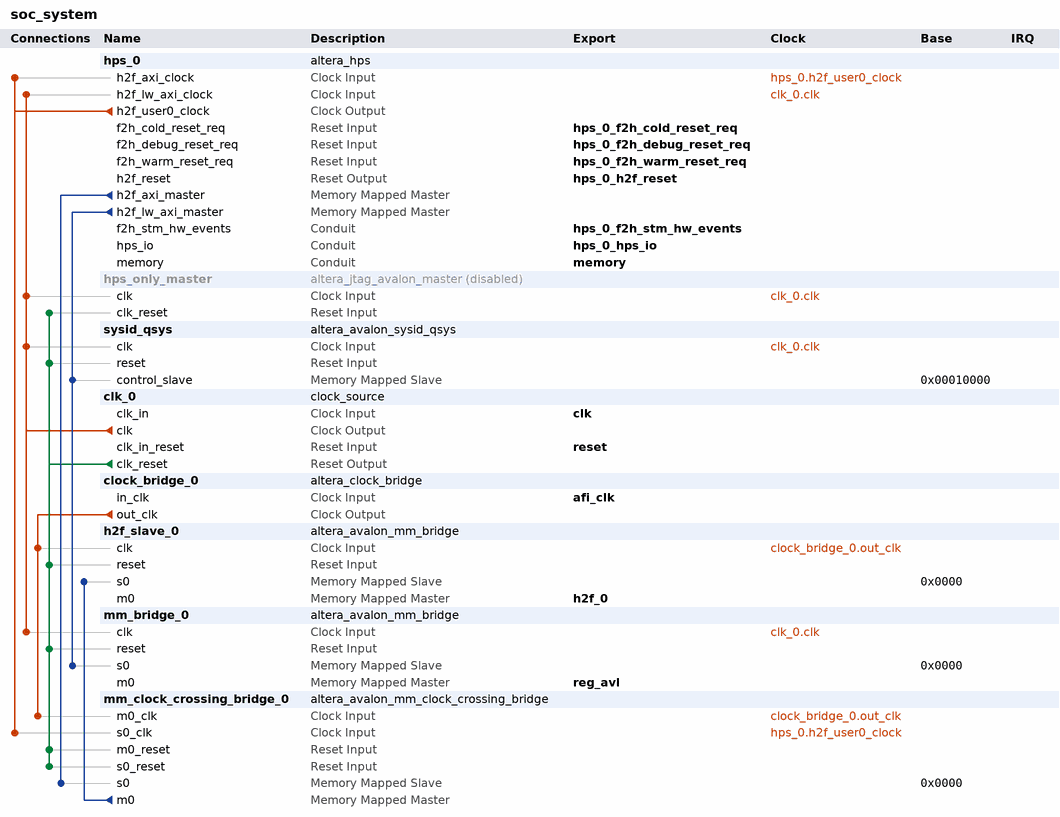
[diagram p0: system contents]
# Platform Designer (Qsys) system soc_system, Cyclone V 5CSXFC6D6F31C6
# Parameters at their usual value, and those the tool derives, are not listed.
package require -exact qsys 13.1
create_system soc_system
set_project_property DEVICE_FAMILY {Cyclone V}
set_project_property DEVICE 5CSXFC6D6F31C6

add_instance hps_0 altera_hps 13.1
set_instance_parameter_value hps_0 MEM_VENDOR Other
set_instance_parameter_value hps_0 MEM_ROW_ADDR_WIDTH 15
set_instance_parameter_value hps_0 MEM_COL_ADDR_WIDTH 10
set_instance_parameter_value hps_0 MEM_DQ_WIDTH 32
set_instance_parameter_value hps_0 MEM_BANKADDR_WIDTH 3
set_instance_parameter_value hps_0 MEM_DRV_STR RZQ/6
set_instance_parameter_value hps_0 MEM_RTT_NOM RZQ/6
set_instance_parameter_value hps_0 MEM_RTT_WR {Dynamic ODT off}
set_instance_parameter_value hps_0 MEM_WTCL 7
set_instance_parameter_value hps_0 MEM_TCL 7
set_instance_parameter_value hps_0 TIMING_TIS 175
set_instance_parameter_value hps_0 TIMING_TIH 250
set_instance_parameter_value hps_0 TIMING_TDS 50
set_instance_parameter_value hps_0 TIMING_TDH 125
set_instance_parameter_value hps_0 TIMING_TDQSQ 120
set_instance_parameter_value hps_0 TIMING_TDQSCK 400
set_instance_parameter_value hps_0 TIMING_TQSH 0.38
set_instance_parameter_value hps_0 MEM_TRAS_NS 35.0
set_instance_parameter_value hps_0 MEM_TRCD_NS 13.75
set_instance_parameter_value hps_0 MEM_TRP_NS 13.75
set_instance_parameter_value hps_0 MEM_TRFC_NS 300.0
set_instance_parameter_value hps_0 MEM_TFAW_NS 37.5
set_instance_parameter_value hps_0 REF_CLK_FREQ 25.0
set_instance_parameter_value hps_0 DEFAULT_FAST_SIM_MODEL true
set_instance_parameter_value hps_0 TIMING_BOARD_MAX_CK_DELAY 0.6
set_instance_parameter_value hps_0 TIMING_BOARD_MAX_DQS_DELAY 0.6
set_instance_parameter_value hps_0 TIMING_BOARD_SKEW_CKDQS_DIMM_MIN -0.01
set_instance_parameter_value hps_0 TIMING_BOARD_SKEW_CKDQS_DIMM_MAX 0.01
set_instance_parameter_value hps_0 TIMING_BOARD_SKEW_WITHIN_DQS 0.02
set_instance_parameter_value hps_0 TIMING_BOARD_SKEW_BETWEEN_DQS 0.02
set_instance_parameter_value hps_0 TIMING_BOARD_DQ_TO_DQS_SKEW 0.0
set_instance_parameter_value hps_0 TIMING_BOARD_AC_SKEW 0.02
set_instance_parameter_value hps_0 TIMING_BOARD_AC_TO_CK_SKEW 0.0
set_instance_parameter_value hps_0 MEM_CLK_FREQ 400.0
set_instance_parameter_value hps_0 HPS_PROTOCOL DDR3
set_instance_parameter_value hps_0 STM_Enable true
set_instance_parameter_value hps_0 F2S_Width 0
set_instance_parameter_value hps_0 S2F_Width 3
set_instance_parameter_value hps_0 LWH2F_Enable true
set_instance_parameter_value hps_0 F2SCLK_DBGRST_Enable true
set_instance_parameter_value hps_0 F2SCLK_WARMRST_Enable true
set_instance_parameter_value hps_0 F2SCLK_COLDRST_Enable true
set_instance_parameter_value hps_0 F2SINTERRUPT_Enable true
set_instance_parameter_value hps_0 EMAC1_PinMuxing {HPS I/O Set 0}
set_instance_parameter_value hps_0 EMAC1_Mode RGMII
set_instance_parameter_value hps_0 QSPI_PinMuxing {HPS I/O Set 0}
set_instance_parameter_value hps_0 QSPI_Mode {1 SS}
set_instance_parameter_value hps_0 SDIO_PinMuxing {HPS I/O Set 0}
set_instance_parameter_value hps_0 SDIO_Mode {4-bit Data}
set_instance_parameter_value hps_0 USB1_PinMuxing {HPS I/O Set 0}
set_instance_parameter_value hps_0 USB1_Mode SDR
set_instance_parameter_value hps_0 SPIM0_PinMuxing {HPS I/O Set 0}
set_instance_parameter_value hps_0 SPIM0_Mode {Single Slave Select}
set_instance_parameter_value hps_0 SPIM1_PinMuxing {HPS I/O Set 0}
set_instance_parameter_value hps_0 SPIM1_Mode {Single Slave Select}
set_instance_parameter_value hps_0 UART0_PinMuxing {HPS I/O Set 0}
set_instance_parameter_value hps_0 UART0_Mode {No Flow Control}
set_instance_parameter_value hps_0 I2C0_PinMuxing Unused
set_instance_parameter_value hps_0 I2C0_Mode N/A
set_instance_parameter_value hps_0 I2C1_PinMuxing {HPS I/O Set 0}
set_instance_parameter_value hps_0 I2C1_Mode I2C
set_instance_parameter_value hps_0 S2FCLK_USER0CLK_Enable true
set_instance_parameter_value hps_0 S2FCLK_USER1CLK_FREQ 100
set_instance_parameter_value hps_0 FPGA_PERIPHERAL_OUTPUT_CLOCK_FREQ_EMAC0_MD_CLK 100
set_instance_parameter_value hps_0 FPGA_PERIPHERAL_OUTPUT_CLOCK_FREQ_EMAC0_GTX_CLK 100
set_instance_parameter_value hps_0 FPGA_PERIPHERAL_OUTPUT_CLOCK_FREQ_EMAC1_MD_CLK 100
set_instance_parameter_value hps_0 FPGA_PERIPHERAL_OUTPUT_CLOCK_FREQ_EMAC1_GTX_CLK 100

add_instance hps_only_master altera_jtag_avalon_master 13.1
set_instance_property hps_only_master ENABLED false

add_instance sysid_qsys altera_avalon_sysid_qsys 13.1
set_instance_parameter_value sysid_qsys id -1395322110

add_instance clk_0 clock_source 13.1
set_instance_parameter_value clk_0 clockFrequency 50000000

add_instance clock_bridge_0 altera_clock_bridge 13.1
set_instance_parameter_value clock_bridge_0 DERIVED_CLOCK_RATE 0
set_instance_parameter_value clock_bridge_0 EXPLICIT_CLOCK_RATE 0

add_instance h2f_slave_0 altera_avalon_mm_bridge 13.1
set_instance_parameter_value h2f_slave_0 DATA_WIDTH 128
set_instance_parameter_value h2f_slave_0 ADDRESS_WIDTH 26
set_instance_parameter_value h2f_slave_0 ADDRESS_UNITS WORDS
set_instance_parameter_value h2f_slave_0 MAX_BURST_SIZE 32
set_instance_parameter_value h2f_slave_0 MAX_PENDING_RESPONSES 4

add_instance mm_bridge_0 altera_avalon_mm_bridge 13.1
set_instance_parameter_value mm_bridge_0 DATA_WIDTH 32
set_instance_parameter_value mm_bridge_0 ADDRESS_WIDTH 10
set_instance_parameter_value mm_bridge_0 ADDRESS_UNITS WORDS
set_instance_parameter_value mm_bridge_0 MAX_PENDING_RESPONSES 4

add_instance mm_clock_crossing_bridge_0 altera_avalon_mm_clock_crossing_bridge 13.1
set_instance_parameter_value mm_clock_crossing_bridge_0 DATA_WIDTH 128
set_instance_parameter_value mm_clock_crossing_bridge_0 ADDRESS_WIDTH 26
set_instance_parameter_value mm_clock_crossing_bridge_0 ADDRESS_UNITS WORDS
set_instance_parameter_value mm_clock_crossing_bridge_0 MAX_BURST_SIZE 32
set_instance_parameter_value mm_clock_crossing_bridge_0 COMMAND_FIFO_DEPTH 4
set_instance_parameter_value mm_clock_crossing_bridge_0 RESPONSE_FIFO_DEPTH 64
set_instance_parameter_value mm_clock_crossing_bridge_0 MASTER_SYNC_DEPTH 2
set_instance_parameter_value mm_clock_crossing_bridge_0 SLAVE_SYNC_DEPTH 2

# connections
add_connection clk_0.clk hps_0.h2f_lw_axi_clock clock
add_connection clk_0.clk hps_only_master.clk clock
add_connection clk_0.clk mm_bridge_0.clk clock
add_connection clk_0.clk sysid_qsys.clk clock
add_connection clock_bridge_0.out_clk h2f_slave_0.clk clock
add_connection clock_bridge_0.out_clk mm_clock_crossing_bridge_0.m0_clk clock
add_connection hps_0.h2f_user0_clock hps_0.h2f_axi_clock clock
add_connection hps_0.h2f_user0_clock mm_clock_crossing_bridge_0.s0_clk clock
add_connection clk_0.clk_reset h2f_slave_0.reset reset
add_connection clk_0.clk_reset hps_only_master.clk_reset reset
add_connection clk_0.clk_reset mm_bridge_0.reset reset
add_connection clk_0.clk_reset mm_clock_crossing_bridge_0.m0_reset reset
add_connection clk_0.clk_reset mm_clock_crossing_bridge_0.s0_reset reset
add_connection clk_0.clk_reset sysid_qsys.reset reset
add_connection hps_0.h2f_axi_master mm_clock_crossing_bridge_0.s0 avalon
set_connection_parameter_value hps_0.h2f_axi_master/mm_clock_crossing_bridge_0.s0 baseAddress 0x0000
add_connection hps_0.h2f_lw_axi_master mm_bridge_0.s0 avalon
set_connection_parameter_value hps_0.h2f_lw_axi_master/mm_bridge_0.s0 baseAddress 0x0000
add_connection hps_0.h2f_lw_axi_master sysid_qsys.control_slave avalon
set_connection_parameter_value hps_0.h2f_lw_axi_master/sysid_qsys.control_slave baseAddress 0x00010000
add_connection mm_clock_crossing_bridge_0.m0 h2f_slave_0.s0 avalon
set_connection_parameter_value mm_clock_crossing_bridge_0.m0/h2f_slave_0.s0 baseAddress 0x0000

# exported interfaces
add_interface clk clock sink
set_interface_property clk EXPORT_OF clk_0.clk_in
add_interface reset reset sink
set_interface_property reset EXPORT_OF clk_0.clk_in_reset
add_interface memory conduit end
set_interface_property memory EXPORT_OF hps_0.memory
add_interface hps_0_hps_io conduit end
set_interface_property hps_0_hps_io EXPORT_OF hps_0.hps_io
add_interface hps_0_f2h_stm_hw_events conduit end
set_interface_property hps_0_f2h_stm_hw_events EXPORT_OF hps_0.f2h_stm_hw_events
add_interface hps_0_f2h_warm_reset_req reset sink
set_interface_property hps_0_f2h_warm_reset_req EXPORT_OF hps_0.f2h_warm_reset_req
add_interface hps_0_f2h_debug_reset_req reset sink
set_interface_property hps_0_f2h_debug_reset_req EXPORT_OF hps_0.f2h_debug_reset_req
add_interface hps_0_f2h_cold_reset_req reset sink
set_interface_property hps_0_f2h_cold_reset_req EXPORT_OF hps_0.f2h_cold_reset_req
add_interface reg_avl avalon master
set_interface_property reg_avl EXPORT_OF mm_bridge_0.m0
add_interface hps_0_h2f_reset reset source
set_interface_property hps_0_h2f_reset EXPORT_OF hps_0.h2f_reset
add_interface h2f_0 avalon master
set_interface_property h2f_0 EXPORT_OF h2f_slave_0.m0
add_interface afi_clk clock sink
set_interface_property afi_clk EXPORT_OF clock_bridge_0.in_clk

set_interconnect_requirement {$system} qsys_mm.clockCrossingAdapter HANDSHAKE
set_interconnect_requirement {$system} qsys_mm.maxAdditionalLatency 1

save_system soc_system.qsys
